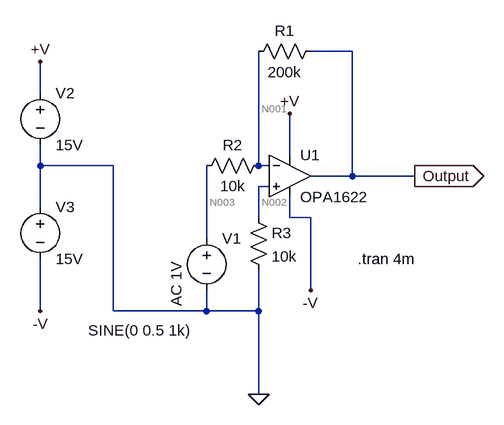
[diagram p0: schematic 25.1_10.(1-1)_transcient_R1=200k.asc]
25.1_10.(1-1)_transcient_R1=200k.asc, the LTspice schematic file:
Version 4
SHEET 1 880 680
WIRE 320 0 256 0
WIRE -160 64 -160 16
WIRE 224 160 224 96
WIRE -160 176 -160 144
WIRE -48 176 -160 176
WIRE 176 176 176 0
WIRE 192 176 176 176
WIRE 320 192 320 0
WIRE 320 192 256 192
WIRE 416 192 320 192
WIRE 192 208 176 208
WIRE -160 240 -160 176
WIRE 176 256 176 208
WIRE 224 256 224 224
WIRE 256 256 224 256
WIRE 96 288 96 176
WIRE 256 368 256 256
WIRE -160 400 -160 320
WIRE -48 400 -48 176
WIRE 96 400 96 368
WIRE 96 400 -48 400
WIRE 176 400 176 336
WIRE 176 400 96 400
WIRE 176 528 176 400
FLAG 416 192 Output
IOPIN 416 192 Out
FLAG 176 528 0
FLAG -160 16 +V
FLAG 224 96 +V
FLAG -160 400 -V
FLAG 256 368 -V
SYMBOL voltage -160 48 R0
WINDOW 123 0 0 Left 2
WINDOW 39 0 0 Left 2
SYMATTR InstName V2
SYMATTR Value 15V
SYMBOL voltage -160 224 R0
WINDOW 123 0 0 Left 2
WINDOW 39 0 0 Left 2
SYMATTR InstName V3
SYMATTR Value 15V
SYMBOL voltage 96 272 R0
WINDOW 123 -47 121 VLeft 2
WINDOW 39 0 0 Left 2
WINDOW 3 -182 158 Left 2
SYMATTR Value2 AC 1V
SYMATTR Value SINE(0 0.5 1k)
SYMATTR InstName V1
SYMBOL res 192 160 R90
WINDOW 0 0 56 VBottom 2
WINDOW 3 32 56 VTop 2
SYMATTR InstName R2
SYMATTR Value 10k
SYMBOL res 160 240 R0
SYMATTR InstName R3
SYMATTR Value 10k
SYMBOL res 272 -16 R90
WINDOW 0 0 56 VBottom 2
WINDOW 3 32 56 VTop 2
SYMATTR InstName R1
SYMATTR Value 200k
SYMBOL Opamps\\OPA1622 224 128 R0
SYMATTR InstName U1
TEXT 328 320 Left 2 !.tran 4m

The netlist it stands for:
* 25.1_10.(1-1)_transcient_R1=200k.asc
V2 +V 0 15V
V3 0 -V 15V
V1 N003 0 SINE(0 0.5 1k) AC 1V
R2 N001 N003 10k
R3 N002 0 10k
R1 Output N001 200k
XU1 N002 N001 +V -V Output OPA1622  ; pins In+ In- V+ V- OUT
.tran 4m
.backanno
.end

* Results of the author's LTspice run, read from the files saved beside the schematic
* Operating Point, zero values left out:
*   V(+v) = 15 V
*   V(-v) = -15 V
*   V(n001) = -11.9 mV
*   V(n002) = -12 mV
*   V(output) = -11.89 mV
*   I(R1) = 41.55 pA
*   I(R3) = -1.2 µA
*   I(R2) = -1.19 µA
*   I(V1) = -1.19 µA
*   I(V3) = -2.6 mA
*   I(V2) = -2.6 mA
*   Ix(u1:IN+) = 1.2 µA
*   Ix(u1:IN-) = 1.19 µA
*   Ix(u1:VCC) = 2.6 mA
*   Ix(u1:VEE) = -2.6 mA
*   Ix(u1:OUT) = -41.55 pA
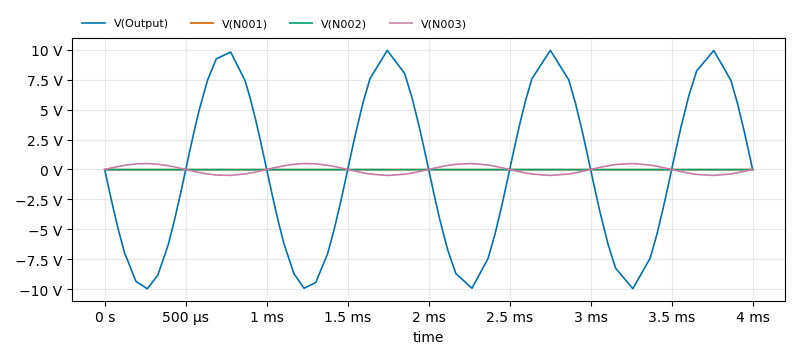
[diagram p1: Transient Analysis of 25.1_10.(1-1)_transcient_R1=200k.asc, plotted from the saved traces]
* Transient Analysis, 1 run:
*   V(Output): min -9.979 V, max 9.962 V, average -31.88 mV, rms 6.943 V, last -5.855 mV
*   V(N001): min -12.19 mV, max -11.4 mV, average -11.9 mV, rms 11.9 mV, last -11.61 mV
*   V(N002): min -12 mV, max -11.98 mV, average -12 mV, rms 12 mV, last -12 mV
*   V(N003): min -498.7 mV, max 498.3 mV, average 999.4 µV, rms 347.1 mV, last 0 V